# EAGLE design CAN_HB_PV&Heatpump (EAGLE 8.4.1)
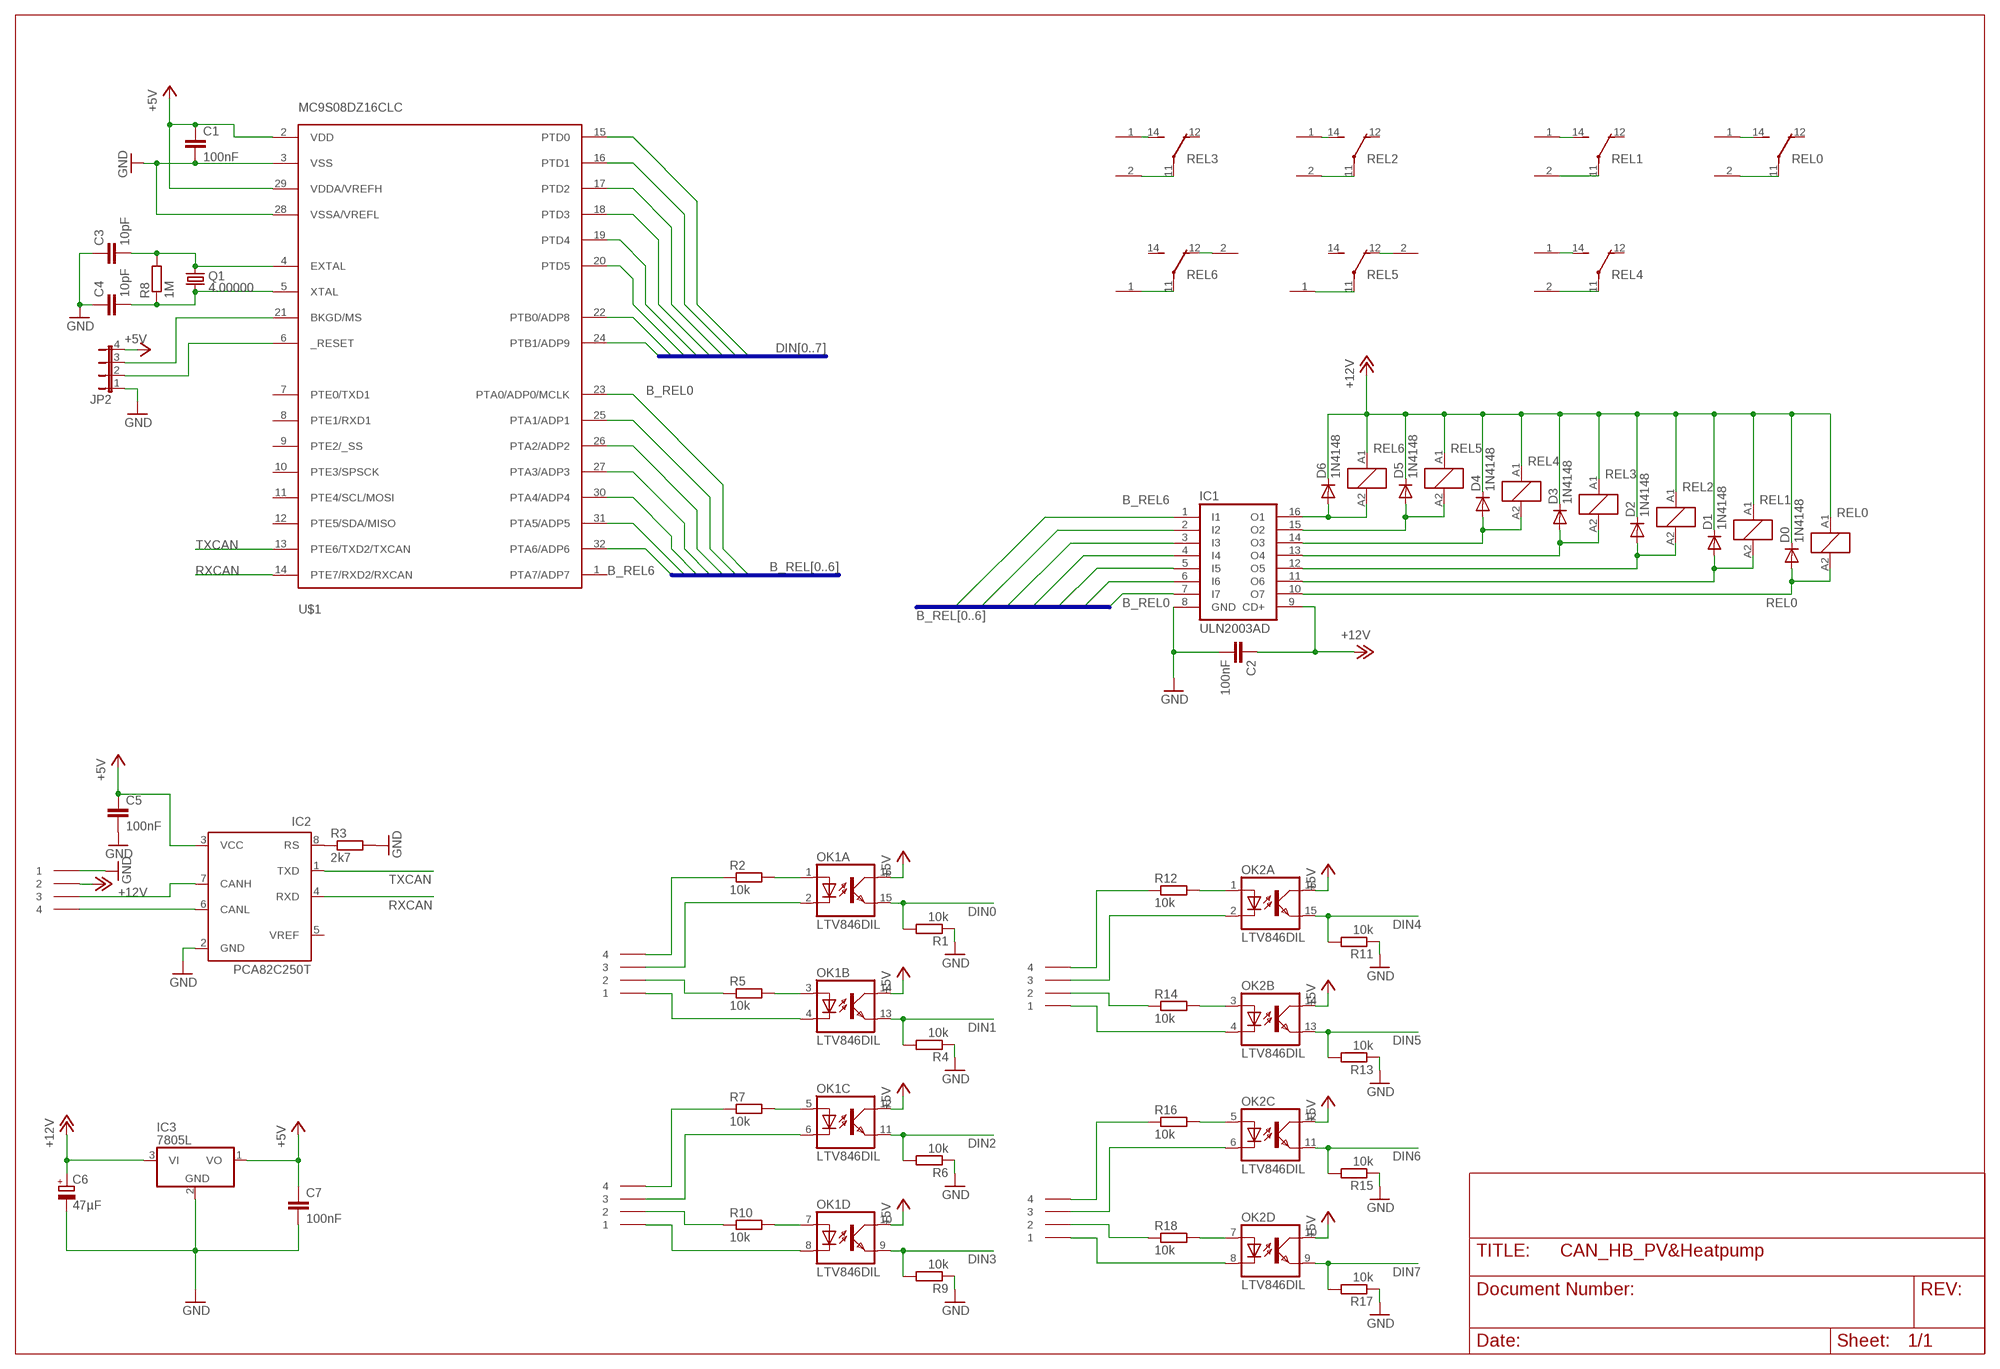
[diagram p0: schematic, sheet 1]

## Parts
C1  100nF  C-EUC0805K  [C0805K]
C2  100nF  C-EUC0805  [C0805]
C3  10pF  C-EUC0805K  [C0805K]
C4  10pF  C-EUC0805K  [C0805K]
C5  100nF  C-EUC0805  [C0805]
C6  47µF  CPOL-EUE2-5  [E2-5]
C7  100nF  C-EUC0805K  [C0805K]
D0  1N4148  DIODE-SOD80C  [SOD80C]
D1  1N4148  DIODE-SOD80C  [SOD80C]
D2  1N4148  DIODE-SOD80C  [SOD80C]
D3  1N4148  DIODE-SOD80C  [SOD80C]
D4  1N4148  DIODE-SOD80C  [SOD80C]
D5  1N4148  DIODE-SOD80C  [SOD80C]
D6  1N4148  DIODE-SOD80C  [SOD80C]
IC1  ULN2003AD  [SO16]
IC2  PCA82C250T  [SO8]
IC3  7805L  [TO92]
JP2  JP4E  [JP4]
KL1  AST021-04  [AST021-04]
KL2  AST021-04  [AST021-04]
KL3  AST021-04  [AST021-04]
KL4  AST021-04  [AST021-04]
KL5  AST021-04  [AST021-04]
OK1  LTV846DIL  [DIL16]
OK2  LTV846DIL  [DIL16]
Q1  4.00000  CRYTALHC49U-V  [HC49U-V]
R1  10k  R-EU_R0805  [R0805]
R2  10k  R-EU_R0805  [R0805]
R3  2k7  R-EU_R0805  [R0805]
R4  10k  R-EU_R0805  [R0805]
R5  10k  R-EU_R0805  [R0805]
R6  10k  R-EU_R0805  [R0805]
R7  10k  R-EU_R0805  [R0805]
R8  1M  R-EU_R0805  [R0805]
R9  10k  R-EU_R0805  [R0805]
R10  10k  R-EU_R0805  [R0805]
R11  10k  R-EU_R0805  [R0805]
R12  10k  R-EU_R0805  [R0805]
R13  10k  R-EU_R0805  [R0805]
R14  10k  R-EU_R0805  [R0805]
R15  10k  R-EU_R0805  [R0805]
R16  10k  R-EU_R0805  [R0805]
R17  10k  R-EU_R0805  [R0805]
R18  10k  R-EU_R0805  [R0805]
REL0  FIN34.51FIN34.51.7  [FIN34]
REL1  FIN34.51FIN34.51.7  [FIN34]
REL2  FIN34.51FIN34.51.7  [FIN34]
REL3  FIN34.51FIN34.51.7  [FIN34]
REL4  FIN34.51FIN34.51.7  [FIN34]
REL5  FIN34.51FIN34.51.7  [FIN34]
REL6  FIN34.51FIN34.51.7  [FIN34]
U$1  MC9S08DZ16CLC  [LQFP32]
U$2  AKL320-02  [AKL320-02]
U$3  AKL320-02  [AKL320-02]
U$4  AKL320-02  [AKL320-02]
U$5  AKL320-02  [AKL320-02]
U$6  AKL320-02  [AKL320-02]
U$14  AKL320-02  [AKL320-02]
U$15  AKL320-02  [AKL320-02]

## Nets
+5V: C1.1 C5.1 C7.1 IC2.3(VCC) IC3.1(VO) JP2.4 OK1.10(D:COL) OK1.12(C:COL) OK1.14(B:COL) OK1.16(A:COL) OK2.10(D:COL) OK2.12(C:COL) OK2.14(B:COL) OK2.16(A:COL) U$1.2(VDD) U$1.29(VDDA/VREFH)
+12V: C2.1 C6.+ D0.C D1.C D2.C D3.C D4.C D5.C D6.C IC1.9(CD+) IC3.3(VI) KL1.P$2 REL0.A1 REL1.A1 REL2.A1 REL3.A1 REL4.A1 REL5.A1 REL6.A1
B_REL0: IC1.7(I7) U$1.23(PTA0/ADP0/MCLK)
B_REL1: IC1.6(I6) U$1.25(PTA1/ADP1)
B_REL2: IC1.5(I5) U$1.26(PTA2/ADP2)
B_REL3: IC1.4(I4) U$1.27(PTA3/ADP3)
B_REL4: IC1.3(I3) U$1.30(PTA4/ADP4)
B_REL5: IC1.2(I2) U$1.31(PTA5/ADP5)
B_REL6: IC1.1(I1) U$1.32(PTA6/ADP6)
BKGD: JP2.3 U$1.21(BKGD/MS)
CANH: IC2.7(CANH) KL1.P$3
CANL: IC2.6(CANL) KL1.P$4
CH4: REL5.12(O) U$5.2
DIN0: OK1.15(A:EMIT) R1.2 U$1.15(PTD0)
DIN0+: KL2.P$4 R2.1
DIN0-: KL2.P$3 OK1.2(A:C)
DIN1: OK1.13(B:EMIT) R4.2 U$1.16(PTD1)
DIN1+: KL2.P$2 R5.1
DIN1-: KL2.P$1 OK1.4(B:C)
DIN2: OK1.11(C:EMIT) R6.2 U$1.17(PTD2)
DIN2+: KL3.P$4 R7.1
DIN2-: KL3.P$3 OK1.6(C:C)
DIN3: OK1.9(D:EMIT) R9.2 U$1.18(PTD3)
DIN3+: KL3.P$2 R10.1
DIN3-: KL3.P$1 OK1.8(D:C)
DIN4: OK2.15(A:EMIT) R11.2 U$1.19(PTD4)
DIN4+: KL4.P$4 R12.1
DIN4-: KL4.P$3 OK2.2(A:C)
DIN5: OK2.13(B:EMIT) R13.2 U$1.20(PTD5)
DIN5+: KL4.P$2 R14.1
DIN5-: KL4.P$1 OK2.4(B:C)
DIN6: OK2.11(C:EMIT) R15.2 U$1.22(PTB0/ADP8)
DIN6+: KL5.P$4 R16.1
DIN6-: KL5.P$3 OK2.6(C:C)
DIN7: OK2.9(D:EMIT) R17.2 U$1.24(PTB1/ADP9)
DIN7+: KL5.P$2 R18.1
DIN7-: KL5.P$1 OK2.8(D:C)
GND: C1.2 C2.2 C3.1 C4.1 C5.2 C6.- C7.2 IC1.8(GND) IC2.2(GND) IC3.2(GND) JP2.1 KL1.P$1 R1.1 R3.2 R4.1 R6.1 R9.1 R11.1 R13.1 R15.1 R17.1 U$1.3(VSS) U$1.28(VSSA/VREFL)
N$1: REL3.11(P) U$2.2
N$2: OK1.1(A:A) R2.2
N$3: IC2.8(RS) R3.1
N$4: REL6.11(P) U$3.1
N$5: REL3.14(S) U$2.1
N$6: REL2.14(S) U$4.1
N$7: REL2.11(P) U$4.2
N$9: C4.2 Q1.1 R8.1 U$1.5(XTAL)
N$10: C3.2 Q1.2 R8.2 U$1.4(EXTAL)
N$11: REL4.11(P) U$14.2
N$12: REL4.14(S) U$14.1
N$13: REL1.11(P) U$6.2
N$14: REL1.14(S) U$6.1
N$15: REL0.11(P) U$15.2
N$16: REL0.14(S) U$15.1
N$17: REL5.11(P) U$5.1
N$20: REL6.12(O) U$3.2
N$23: OK1.3(B:A) R5.2
N$26: OK1.5(C:A) R7.2
N$28: OK1.7(D:A) R10.2
N$32: OK2.1(A:A) R12.2
N$38: OK2.3(B:A) R14.2
N$42: OK2.5(C:A) R16.2
N$44: OK2.7(D:A) R18.2
REL0: D0.A IC1.10(O7) REL0.A2
REL1: D1.A IC1.11(O6) REL1.A2
REL2: D2.A IC1.12(O5) REL2.A2
REL3: D3.A IC1.13(O4) REL3.A2
REL4: D4.A IC1.14(O3) REL4.A2
REL5: D5.A IC1.15(O2) REL5.A2
REL6: D6.A IC1.16(O1) REL6.A2
RESET: JP2.2 U$1.6(_RESET)
RXCAN: IC2.4(RXD) U$1.14(PTE7/RXD2/RXCAN)
TXCAN: IC2.1(TXD) U$1.13(PTE6/TXD2/TXCAN)
Unconnected: IC2.5(VREF) REL0.12(O) REL1.12(O) REL2.12(O) REL3.12(O) REL4.12(O) REL5.14(S) REL6.14(S) U$1.1(PTA7/ADP7) U$1.7(PTE0/TXD1) U$1.8(PTE1/RXD1) U$1.9(PTE2/_SS) U$1.10(PTE3/SPSCK) U$1.11(PTE4/SCL/MOSI) U$1.12(PTE5/SDA/MISO)

## Buses
B_REL[0..6]
DIN[0..7]

## Library data of the parts
C1-C5 C7 = rcl:C-EU: CAPACITOR, European symbol
C6 = rcl:CPOL-EU: POLARIZED CAPACITOR, European symbol
D0 D1-D6 = diode:DIODE-: DIODE
IC1 = uln-udn:ULN2003A: DRIVER ARRAY
IC2 = micro-philips:PCA82C250: CAN CONTROLLER INTERFACE
IC3 = linear:78*: Positive VOLTAGE REGULATOR
JP2 = jumper:JP4E: JUMPER
KL1-KL5 = con-ria:AST021-04
OK1 OK2 = optocoupler:LTV846: OPTO COUPLER Source: LITEON, LTV816.pdf
Q1 = crystal:CRYTAL: CRYSTAL
R1-R18 = rcl:R-EU_: RESISTOR, European symbol
REL0 REL1-REL6 = My:FIN34.51: Finder 34.51.7 Relais
U$1 = MC9S08DZ16CLC:MC9S08DZ16CLC
U$2-U$6 U$14 U$15 = con-ria:AKL320-02

## Board
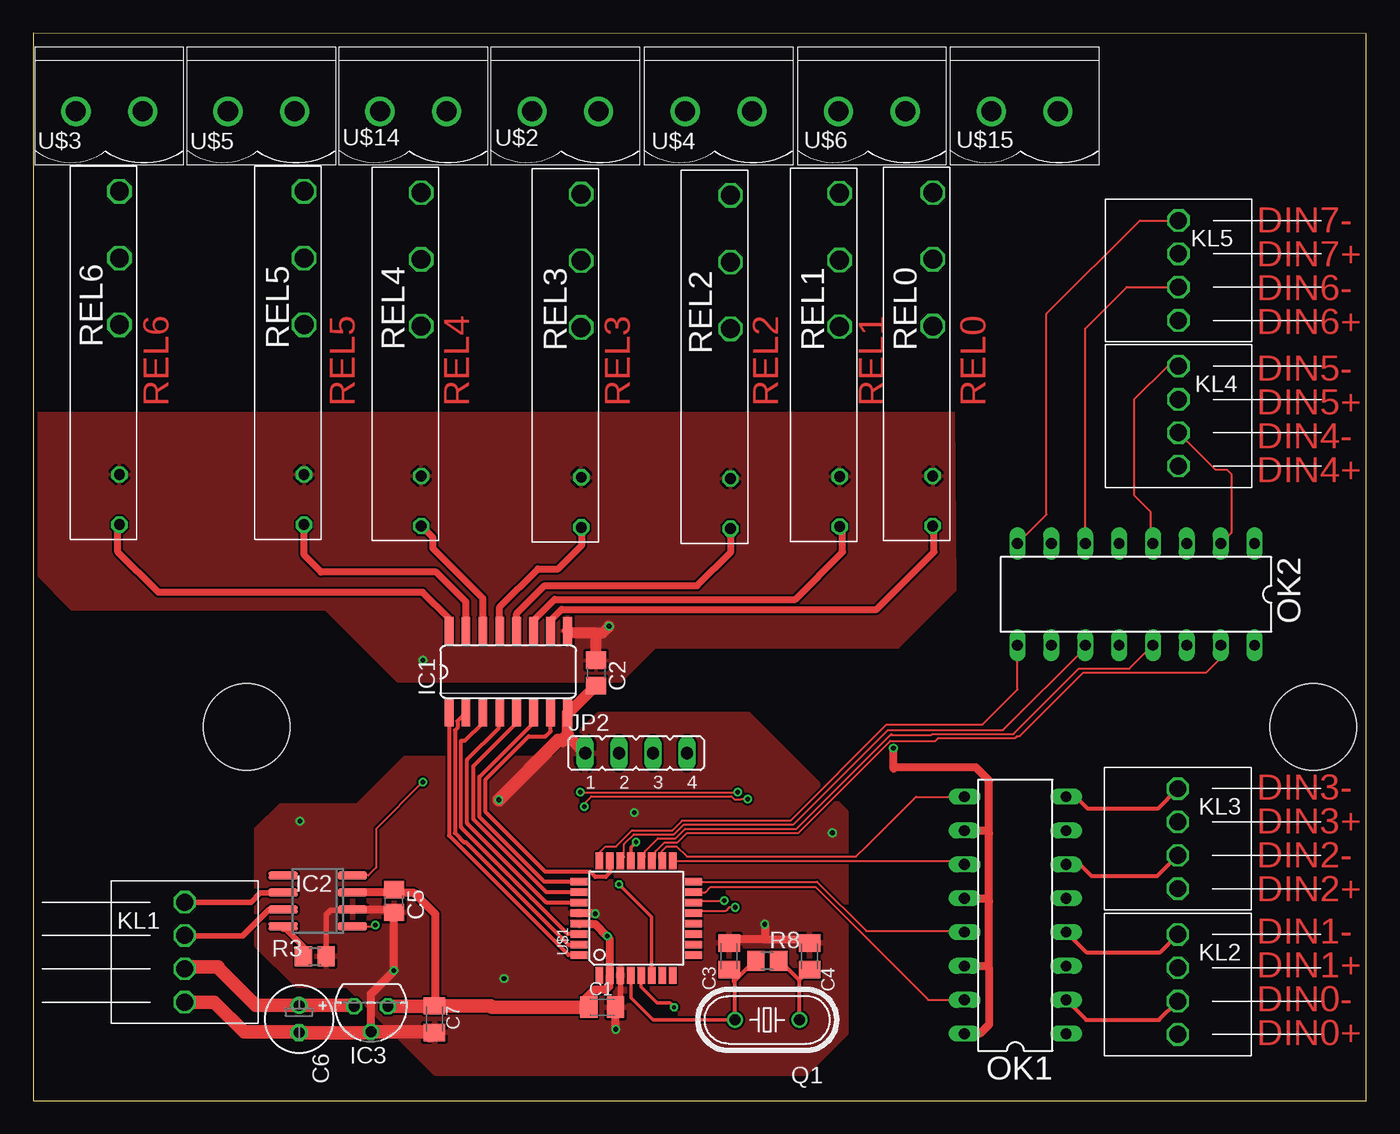
[diagram p1: board, top side]
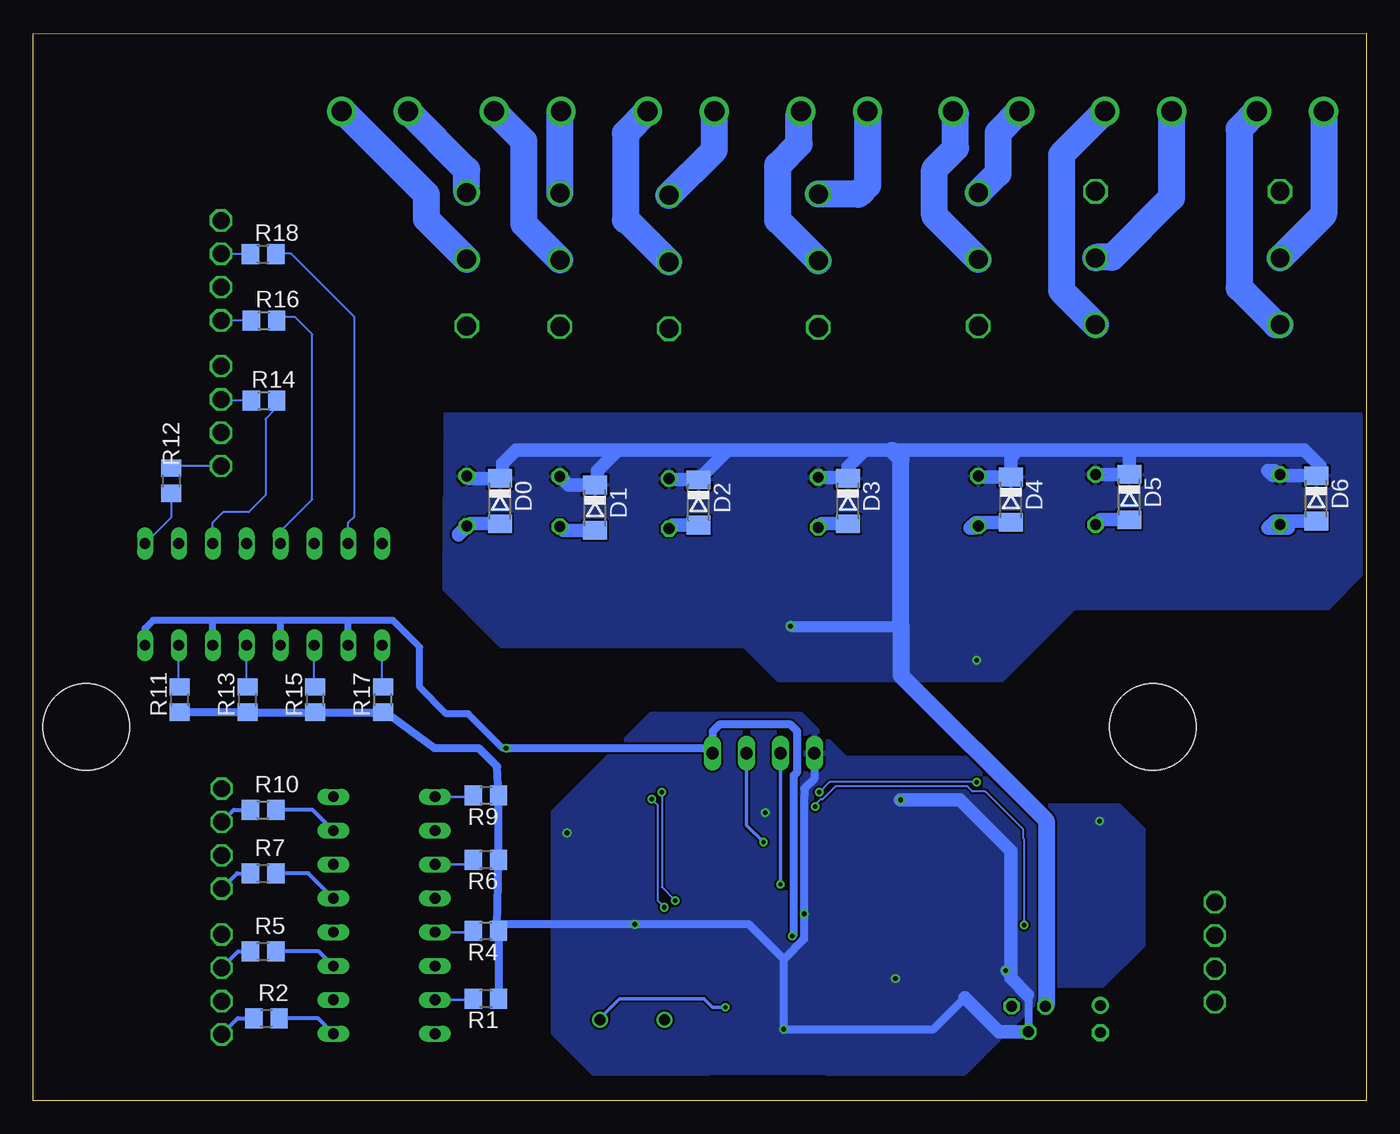
[diagram p2: board, bottom side, seen from below]

Size 99.97 x 80.06 mm. Coordinates in mm from the lower left corner, seen from the top.
Outline: 0,0 99.96,0 99.97,80.01 0,80.06 0,0
Copper layers (1*16): Top 0.035mm / dielectric 1.5mm / Bottom 0.035mm
Design rules "PCB-POOL Standard": minimum track width 0.15mm, minimum drill 0.3mm, track to track 0.15mm, track to pad 0.15mm, pad to pad 0.15mm, via to via 0.15mm, smd to smd 0.15mm, copper to edge 0.3mm, drill to drill 0.2mm, minimum pad ring 0.2mm, minimum via ring 0.15mm, stop-mask expansion 0.075mm, vias tented up to drill 0mil, thermal gap 0.2mm
Holes 6.5 mm at 96,28.02 15.99,28.02

### Footprints (pad centres in the part's own frame; a part is rotated, then mirrored left to right if it is on the bottom)
C0805K = smd 1.3 x 1.6: 1 -1,0; 2 1,0
C0805 = smd 1.3 x 1.5: 1 -0.95,0; 2 0.95,0
C0805' = smd 1.3 x 1.5: 1 -0.85,0; 2 0.85,0
E2-5 = drill 0.813 pad 1.27: + -1.016,0 | drill 0.813 pad 1.27 octagon: - 1.016,0
SOD80C = smd 1.4 x 1.8: A 1.7,0; C -1.7,0
SO16 = smd 0.66 x 2.032: 1 -4.445,-3.073; 2 -3.175,-3.073; 3 -1.905,-3.073; 4 -0.635,-3.073; 5 0.635,-3.073; 6 1.905,-3.073; 7 3.175,-3.073; 8 4.445,-3.073; 9 4.445,3.073; 10 3.175,3.073; 11 1.905,3.073; 12 0.635,3.073; 13 -0.635,3.073; 14 -1.905,3.073; 15 -3.175,3.073; 16 -4.445,3.073
SO8 = smd 0.6 x 2.2: 1 -1.905,-2.6; 2 -0.635,-2.6; 3 0.635,-2.6; 4 1.905,-2.6; 5 1.905,2.6; 6 0.635,2.6; 7 -0.635,2.6; 8 -1.905,2.6
TO92 = drill 0.813 octagon: 1 -1.27,0; 2 0,1.905; 3 1.27,0
JP4 = drill 0.914 long: 1 -3.81,0; 2 -1.27,0; 3 1.27,0; 4 3.81,0
AST021-04 = drill 1.27 octagon: P$1 0,0; P$2 0,2.5; P$3 0,5; P$4 0,7.5
DIL16 = drill 0.813 long: 1 -8.89,-3.81; 2 -6.35,-3.81; 3 -3.81,-3.81; 4 -1.27,-3.81; 5 1.27,-3.81; 6 3.81,-3.81; 7 6.35,-3.81; 8 8.89,-3.81; 9 8.89,3.81; 10 6.35,3.81; 11 3.81,3.81; 12 1.27,3.81; 13 -1.27,3.81; 14 -3.81,3.81; 15 -6.35,3.81; 16 -8.89,3.81
HC49U-V = drill 0.813: 1 -2.413,0; 2 2.413,0
R0805 = smd 1.3 x 1.5: 1 -0.95,0; 2 0.95,0
R0805' = smd 1.3 x 1.5: 1 -0.85,0; 2 0.85,0
FIN34 = drill 1.422 octagon: 11 21.1,1.3; 12 16.1,1.3; 14 26.1,1.3 | drill 0.813 octagon: A1 4.85,1.3; A2 1.1,1.3
LQFP32 = smd 1.27 x 0.559: 1 -4.293,2.743; 2 -4.293,1.956; 3 -4.293,1.168; 4 -4.293,0.381; 5 -4.293,-0.381; 6 -4.293,-1.168; 7 -4.293,-1.956; 8 -4.293,-2.743; 17 4.293,-2.743; 18 4.293,-1.956; 19 4.293,-1.168; 20 4.293,-0.381; 21 4.293,0.381; 22 4.293,1.168; 23 4.293,1.956; 24 4.293,2.743 | smd 0.559 x 1.27: 9 -2.743,-4.293; 10 -1.956,-4.293; 11 -1.168,-4.293; 12 -0.381,-4.293; 13 0.381,-4.293; 14 1.168,-4.293; 15 1.956,-4.293; 16 2.743,-4.293; 25 2.743,4.293; 26 1.956,4.293; 27 1.168,4.293; 28 0.381,4.293; 29 -0.381,4.293; 30 -1.168,4.293; 31 -1.956,4.293; 32 -2.743,4.293
AKL320-02 = drill 1.5 pad 2.184: 1 0,0; 2 0,5

### Placement (x,y rotation side)
C1  42.67,7.01 0 top
C2  42.22,32.09 270 top
C3  52.19,10.82 270 top
C4  58.22,10.82 270 top
C5  100nF  [C0805']  27.05,14.98 270 top
C6  19.93,6.12 270 top
C7  30.09,6.12 270 top
D0  64.98,44.98 270 bottom
D1  57.85,44.47 270 bottom
D2  50.07,44.87 270 bottom
D3  38.87,44.97 270 bottom
D4  26.67,45.07 270 bottom
D5  17.77,45.27 270 bottom
D6  3.73,45.17 270 bottom
IC1  35.62,32.17 0 top
IC2  21.33,14.98 90 top
IC3  25.33,7.07 180 top
JP2  45.21,26.06 0 top
KL1  11.36,7.39 0 top
KL2  85.85,12.47 180 top
KL3  85.85,23.4 180 top
KL4  85.89,55.1 180 top
KL5  85.89,66.03 180 top
OK1  73.66,13.91 90 top
OK2  82.7,37.98 180 top
Q1  55.05,6.06 180 top
R1  66.02,7.64 180 bottom
R2  82.48,6.18 0 bottom
R3  2k7  [R0805']  21.12,10.83 0 top
R4  66.02,12.72 180 bottom
R5  82.74,11.2 0 bottom
R6  66.02,18.05 180 bottom
R7  82.74,17.05 0 bottom
R8  1M  [R0805']  55.05,10.5 180 top
R9  66.02,22.88 180 bottom
R10  82.74,21.82 0 bottom
R11  88.98,30.09 90 bottom
R12  89.63,46.5 270 bottom
R13  83.9,30.09 90 bottom
R14  82.67,52.5 0 bottom
R15  78.81,30.09 90 bottom
R16  82.67,58.52 0 bottom
R17  73.73,30.09 90 bottom
R18  82.74,63.5 0 bottom
REL0  68.76,42.01 90 top
REL1  61.78,41.96 90 top
REL2  53.59,41.8 90 top
REL3  42.39,41.9 90 top
REL4  30.39,42 90 top
REL5  21.6,42.1 90 top
REL6  7.76,42.1 90 top
U$1  45.21,13.68 90 top
U$2  37.39,74.2 270 top
U$3  3.2,74.2 270 top
U$4  48.89,74.2 270 top
U$5  14.59,74.2 270 top
U$6  60.39,74.2 270 top
U$14  26,74.2 270 top
U$15  71.85,74.2 270 top

### Tracks (layer width: path | path; a pad name or v marks a point on that pad's centre or on a via)
+5V  (via drill 0.35)
  Top 0.152: 49.27,25.81 JP2.4
  Top 0.305: 26.41,15.62 27.05,15.62 | C5.1 27.05,15.93 26.73,15.93
  Top 0.61: C7.1 30.14,7.12 30.14,14 28.52,15.62 27.05,15.62 | C5.1 26.83,15.83 26.73,15.93 26.41,15.62 IC2.3 | C1.1 41.4,7.28 41.4,7.64 42.05,8.3 42.93,8.3 43.2,8.56 43.2,9.33 U$1.2 43.25,12.14 v43.05,12.34 42.16,13.23 41.75,13.23 41.74,13.24 40.97,13.24 U$1.29 | 64.51,24.91 64.51,25.02 | 64.51,25.02 v64.51,26.44 | 64.51,25.02 70.68,25.02 71.68,24.02 71.68,20.02 | 71.68,14.94 71.68,20.02 | 71.68,9.86 71.68,14.94 | 71.68,9.86 71.68,5.7 71,5.02 OK1.16 | OK1.10 71.44,20.26 arc-90 71.68,20.02 | OK1.12 71.44,15.18 arc-90 71.68,14.94 | OK1.14 71.44,10.1 arc-90 71.68,9.86
  Top 1.016: IC3.1 30.09,7.07 C7.1 30.1,7.13 34.28,7.13 34.41,7.01 C1.1
  Bottom 0.508: v64.51,26.44 64.77,26.44 67.35,29.02 69,29.02 71,31.02 71,34.02 73,36.02 76.36,36.02 | 81.44,36.02 86.52,36.02 | 76.36,36.02 81.44,36.02 | 86.52,36.02 91,36.02 91.59,35.42 OK2.16 | OK2.14 86.52,36.02 | OK2.12 81.44,36.02 | OK2.10 76.36,36.02
  Bottom 0.61: v43.05,12.34 42.92,12.47 42.92,24.4 42.67,24.66 42.67,27.71 43.17,28.21 48.51,28.21 49.02,27.71 JP2.4 49.02,26.44 v64.51,26.44
+12V  (via drill 0.35)
  Top 0.813: IC1.9 40.24,35.07 42.22,35.07 | v43.17,35.58 42.67,35.07 42.22,35.07 | C2.1 42.22,35.07
  Top 1.016: IC3.3 23.99,7.14 C6.+ 16.69,7.14 13.85,9.97 13.85,10.04 11.5,10.04 KL1.P$2
  Bottom 0.15: REL6.A1 6.42,46.95 6.34,46.87
  Bottom 0.813: KL1.P$2 11.36,9.96 | v43.17,35.58 34.88,35.58
  Bottom 1.016: 6.85,47.26 7.36,47.26 6.97,46.87 6.34,46.87 D6.C 3.42,47.52 | REL5.A1 17.79,46.95 D5.C | REL4.A1 29.02,46.77 D4.C 26.67,48.28 26.16,48.79 | 17.78,46.98 D5.C | REL3.A1 38.95,46.75 D3.C 38.87,47.51 37.59,48.79 | 37.59,48.79 35.55,48.79 26.16,48.79 | 37.59,48.79 47.85,48.79 | 47.85,48.79 D2.C 52.21,46.57 REL2.A1 | 47.85,48.79 56.13,48.79 | 56.13,48.79 57.65,47.26 57.65,46.37 D1.C 59.84,46.17 REL1.A1 | 56.13,48.79 63.75,48.79 64.77,47.77 64.77,46.89 D0.C 67.28,46.68 REL0.A1 | 17.78,48.79 26.16,48.79 | 17.78,48.79 4.63,48.79 3.49,47.64 | D5.C 17.77,48.78 17.78,48.79
  Bottom 1.27: IC3.3 24,7.13 24,21.02 34.88,31.91 34.88,35.58 34.88,48.12 35.55,48.79
  other vias: 29.21,33.04
  pour Top: 0.25,51.58 0.25,39.45 2.85,36.85 21.9,36.85 27.3,31.45 44.13,31.45 46.67,33.99 64.89,33.99 69.21,38.31 69.21,38.44 69.08,51.58
  pour Bottom: 0.25,51.58 0.25,39.45 2.85,36.85 21.9,36.85 27.3,31.45 44.13,31.45 46.67,33.99 64.89,33.99 69.21,38.31 69.21,39.07 69.08,51.58
B_REL0
  Top 0.305: U$1.23 43.25,17.11 42.92,16.78 42.16,16.78 41.78,17.16 38.41,17.16 33.92,21.65 33.92,24.1 37.15,27.32 38.41,27.32 38.79,27.71 IC1.7
B_REL1
  Top 0.305: 40.35,16.42 U$1.25 38.34,16.42 33.47,21.29 33.47,24.29 37.59,28.4 37.59,29.04 IC1.6
B_REL2
  Top 0.305: U$1.26 38.48,15.63 33.02,21.1 33.02,25.1 36.19,28.28 36.19,29.04 IC1.5
B_REL3
  Top 0.305: U$1.27 38.51,14.85 32.54,20.82 32.54,25.58 34.92,27.96 34.92,29.04 IC1.4
B_REL4
  Top 0.305: U$1.30 40.08,12.51 32.08,20.51 32.08,27.01 32.38,27.01 33.71,28.34 IC1.3
B_REL5
  Top 0.15: 40.89,11.7 U$1.31
  Top 0.305: 40.89,11.7 40.13,11.7 32.44,19.39 32.32,19.39 31.63,20.08 31.63,27.78 31.81,27.96 31.81,28.46 IC1.2
B_REL6
  Top 0.305: U$1.32 40.13,10.94 31.17,19.89 IC1.1
BKGD  (via drill 0.3)
  Top 0.254: U$1.21 44.83,19.01 v45.21,19.39
  Bottom 0.254: v45.21,19.39 46.48,20.66 JP2.3
CANH
  Top 0.406: IC2.7 17.68,14.35 15.71,12.38 11.37,12.38 KL1.P$3
CANL
  Top 0.406: KL1.P$4 16.32,14.89 17.01,15.58 18.7,15.58 IC2.6
CH4
  Bottom 2.032: U$5.2 22.86,70.94 22.86,60.76 REL5.12
DIN0
  Top 0.15: 50.79,16.02 58.67,16.02 58.8,15.89
  Top 0.152: U$1.15 50.41,15.63 50.79,16.02 | 58.8,15.89 67.13,7.56 OK1.15
  Bottom 0.2: OK1.15 66.95,7.56 R1.2
DIN0+
  Bottom 0.305: KL2.P$4 84.63,6.18 R2.1
DIN0-
  Top 0.305: OK1.2 78.97,6.05 84.43,6.05 KL2.P$3
DIN1
  Top 0.152: U$1.16 58.78,16.42 62.48,12.72 69.77,12.72 OK1.13
  Bottom 0.2: OK1.13 66.95,12.64 R4.2
DIN1+
  Bottom 0.305: KL2.P$2 84.62,11.2 R5.1
DIN1-
  Top 0.305: OK1.4 78.97,11.13 84.51,11.13 KL2.P$1
DIN2
  Top 0.152: U$1.17 69.59,17.97 OK1.11
  Bottom 0.2: OK1.11 67.2,17.72 R6.2
DIN2+
  Bottom 0.305: KL3.P$4 84.7,17.05 R7.1
DIN2-
  Top 0.305: OK1.6 78.5,17.72 79.37,16.85 84.29,16.85 KL3.P$3
DIN3
  Top 0.15: 47.49,19.07 48.25,19.07 49.02,18.31 61.72,18.31 62.48,19.07
  Top 0.152: U$1.18 47.16,18.74 47.49,19.07 | 62.48,19.07 66.21,22.8 OK1.9
  Bottom 0.2: OK1.9 66.95,22.8 R9.2
DIN3+
  Bottom 0.305: KL3.P$2 84.93,21.82 R10.1
DIN3-
  Top 0.305: OK1.8 78.18,22.8 79.05,21.93 84.37,21.93 KL3.P$1
DIN4
  Top 0.152: U$1.19 46.66,18.25 46.66,18.7 47.33,19.37 48.3,19.37 49.02,20.09 57.38,20.09 64.28,26.99 67.67,26.99 67.88,27.2 73.64,27.2 73.77,27.32 73.97,27.32 78.73,32.09 87.94,32.09 89.06,33.2 OK2.15
  Bottom 0.152: R11.2 89.06,31.02 OK2.15
DIN4+
  Bottom 0.152: KL4.P$4 89.38,47.6 R12.1
DIN4-
  Top 0.152: KL4.P$3 88.67,47.33 89.53,47.33 89.85,47.01 89.85,42.58 OK2.2
DIN5
  Top 0.15: 64.29,27.42 67.36,27.42 67.43,27.5
  Top 0.152: U$1.20 45.87,18.25 45.87,18.7 46.84,19.67 48.18,19.67 48.89,20.39 57.26,20.39 64.29,27.42 64.37,27.5 | 67.43,27.5 73.51,27.5 78.42,32.4 82.21,32.4 OK2.13
  Bottom 0.152: R13.2 83.98,31.02 OK2.13
DIN5+
  Bottom 0.152: R14.1 85.79,52.5 KL4.P$2
DIN5-
  Top 0.152: OK2.4 83.81,41.95 83.81,44.15 82.55,45.42 82.55,52.57 85.08,55.1 KL4.P$1
DIN6
  Top 0.15: 64.1,27.8 72.74,27.8 78.9,33.96 OK2.11
  Top 0.152: U$1.22 44.32,18.25 44.32,19.25 45.04,19.98 48.05,19.98 48.77,20.69 56.99,20.69 64.1,27.8
  Bottom 0.152: R15.2 78.9,31.02 OK2.11
DIN6+
  Bottom 0.152: R16.1 85.88,58.52 KL5.P$4
DIN6-
  Top 0.152: OK2.6 78.9,57.92 82,61.03 KL5.P$3
DIN7
  Top 0.15: 64,28.21 71.19,28.21 73.81,30.84 OK2.9
  Top 0.152: U$1.24 42.46,18.61 42.92,19.07 43.71,19.07 44.92,20.28 47.93,20.28 48.64,20.99 56.78,20.99 64,28.21
  Bottom 0.152: R17.2 73.81,31.02 OK2.9
DIN7+
  Bottom 0.152: R18.1 85.87,63.5 KL5.P$2
DIN7-
  Top 0.152: OK2.8 76,43.97 76,59.02 83,66.03 KL5.P$1
GND  (via drill 0.35)
  Top 0.406: C1.2 43.62,7.01 44.04,7.43 U$1.3 | R3.2 21.97,13.93 22.31,14.28 23.87,14.28 IC2.2
  Top 0.61: C7.2 30.09,5.17 | IC3.2 25.33,8.03 v27.05,9.75 27.05,14.03 | 27.05,14.03 C5.2 | IC2.2 26.73,14.35 27.05,14.03 | v42.14,14.01 42.09,14.06 U$1.28 | v43.68,5.35 43.67,5.37 C1.2 | C4.1 57.67,11.82 57.4,12.09 54.86,12.09 | C3.1 52.46,12.09 54.86,12.09 | v54.86,13.23 54.86,12.09
  Top 0.813: JP2.1 40.06,27.39 IC1.8 40.19,29.1 C2.2
  Top 1.016: KL1.P$1 13.58,7.39 15.8,5.17 19.93,5.17 C6.- 25.26,5.1 IC3.2 29.45,5.17 29.77,4.85 30.04,5.12 C7.2 | 40.06,27.39 39.68,27.01 39.37,27.01 v34.92,22.56
  Bottom 0.2: 65.17,13.02 R4.1
  Bottom 0.61: JP2.1 41.4,24.15 42.14,23.41 42.14,22.81 42.16,22.79 42.16,13.99 v42.14,14.01 42.16,13.99 42.16,12.12 43.68,10.6 | 30.09,7.71 32.44,5.35 v43.68,5.35 43.68,10.6 | 43.68,10.6 46.31,13.23 v54.86,13.23 64.96,13.23 65.17,13.02 R6.1 R9.1 65.17,25.06 66.54,26.44 69.84,26.44 73.65,29.24 R17.1 R15.1 R13.1 R11.1 | 25.39,7.96 25.33,7.89 IC3.2 | R4.1 R1.1
  Bottom 0.813: v27.05,9.75 26.67,9.36 26.67,9.23
  Bottom 1.016: 30.09,7.71 27.55,5.17 IC3.2 | 25.39,7.96 26.67,9.23 26.67,18.75 30.48,22.56 v34.92,22.56
  other vias: 35.3,9.16 59.94,20.09 45.08,21.61 20,20.97
  pour Bottom: 57.91,2.05 60.95,5.1 60.95,21.61 53.59,28.98 42.41,28.98 39.11,25.67 27.94,25.67 24.38,22.12 18.54,22.12 16.76,20.34 16.76,11.7 19.81,8.66 23.62,8.66 30.22,2.05 40.38,2.05 40.63,2.11
  pour Top: 16.76,20.34 18.54,22.12 24.38,22.12 27.94,25.67 39.11,25.67 42.41,28.98 53.59,28.98 60.95,21.61 60.95,5.1 57.91,2.05 30.22,2.05 23.62,8.66 19.81,8.66 16.76,11.7 16.76,19.07
N$1
  Bottom 2.032: REL3.11 44.13,66.04 44.13,70.19 42.54,71.77 42.54,74.06 U$2.2
N$2
  Bottom 0.305: OK1.1 78.62,6.18 R2.2
N$3
  Top 0.406: 18.73,12.87 IC2.8 20.27,11.54 R3.1
N$4
  Bottom 2.032: U$3.1 3.2,66.47 REL6.11
N$5
  Bottom 2.032: U$2.1 37.39,68.66 38.09,67.96 38.13,68 REL3.14
N$6
  Bottom 2.032: REL2.14 48.89,71.3 U$4.1
N$7
  Bottom 2.032: U$4.2 55.56,72.54 55.56,66.06 55.45,66.06 REL2.11
N$9  (via drill 0.3)
  Top 0.254: 58.22,9.87 C4.2 58.22,9.8 57.46,9.04 | U$1.5 45.59,8.53 46.79,7.33 47.75,7.33 v48.06,7.01
  Top 0.305: 57.59,6.06 Q1.1 57.46,9.04 56,10.5 R8.1
  Bottom 0.254: Q1.1 57.59,6.06 56,7.65 49.65,7.65 49.02,7.01 v48.06,7.01
N$10
  Top 0.254: 52.64,9.04 52.51,8.92 52.51,9.5 C3.2 | U$1.4 44.83,7.71 46.48,6.06 Q1.2
  Top 0.305: R8.2 54.1,10.5 52.64,9.04 Q1.2
N$11
  Bottom 2.032: REL4.11 32.38,66.39 32.38,69.87 30.79,71.46 30.79,74 U$14.2
N$12
  Bottom 2.032: U$14.1 27.62,72.58 27.62,69.55 29.07,68.1 REL4.14
N$13
  Bottom 2.032: REL1.11 63.18,65.76 63.18,71.99 U$6.2
N$14
  Bottom 2.032: REL1.14 60.48,74.12 U$6.1
N$15
  Bottom 2.032: REL0.11 70.48,66.13 70.48,67.96 76.72,74.2 U$15.2
N$16
  Bottom 2.032: REL0.14 67.46,69.81 U$15.1
N$17
  Bottom 2.032: U$5.1 14.59,67.72 19.05,63.27 20.23,63.27 REL5.11
N$20
  Bottom 2.032: U$3.2 9.52,72.88 9.52,60.98 6.74,58.2 REL6.12
N$23
  Bottom 0.305: OK1.3 78.56,11.2 R5.2
N$26
  Bottom 0.305: OK1.5 79.34,17.05 R7.2
N$28
  Bottom 0.305: OK1.7 79.02,21.82 R10.2
N$32
  Bottom 0.152: R12.2 89.63,43.76 OK2.1
N$38
  Bottom 0.152: OK2.3 86.52,43.36 85.72,44.15 83.81,44.15 82.55,45.42 82.55,51.14 81.82,51.86 R14.2
N$42
  Bottom 0.152: OK2.5 81.44,42.72 79.05,45.1 79.05,57.49 80.32,58.76 81.58,58.76 R16.2
N$44
  Bottom 0.152: OK2.7 76.36,43.36 75.88,43.83 75.88,58.76 80.64,63.52 81.87,63.52 R18.2
REL0
  Top 0.508: IC1.10 38.79,36.02 39.62,36.85 63.24,36.85 67.56,41.17 67.56,43.01 REL0.A2
  Bottom 1.016: D0.A 67.22,43.28 68.07,42.44 68.07,42.5 REL0.A2
REL1
  Top 0.508: IC1.11 37.52,36.02 39.11,37.61 57.14,37.61 60.7,41.17 60.7,42.83 REL1.A2
  Bottom 1.016: D1.A 60.19,42.77 REL1.A2
REL2
  Top 0.508: IC1.12 36.25,36.53 38.35,38.63 49.78,38.63 52.32,41.17 52.32,42.88 REL2.A2
  Bottom 1.016: D2.A 52.02,43.17 REL2.A2
REL3
  Top 0.508: IC1.13 34.98,37.04 37.84,39.9 39.36,39.9 41.14,41.68 41.14,42.96 REL3.A2
  Bottom 1.016: D3.A 40.82,43.27 REL3.A2
REL4
  Top 0.508: IC1.14 33.71,37.67 29.97,41.42 29.97,42.23 REL4.A2
  Bottom 1.016: D4.A 29.29,43.37 29.71,42.95 29.25,42.95 REL4.A2
REL5
  Top 0.508: IC1.15 32.44,37.42 30.22,39.64 21.59,39.64 20.32,40.91 20.32,43.18 REL5.A2
  Bottom 1.016: D5.A 19.93,43.57 REL5.A2
REL6
  Top 0.508: IC1.16 31.17,36.15 29.21,38.12 9.39,38.12 6.34,41.17 6.34,43.09 REL6.A2
  Bottom 1.016: D6.A 6.83,43.47 7.36,42.95 6.2,42.95 | 5.84,42.95 6.2,42.95 | 6.2,42.95 REL6.A2
RESET  (via drill 0.3)
  Top 0.254: U$1.6 46.38,13.78 v43.94,16.22
  Bottom 0.254: v43.94,16.22 JP2.2
RXCAN  (via drill 0.35)
  Top 0.15: 28.95,23.9 v29.21,23.9 | v41.02,23.13 v52.83,23.13 | 49.66,15.01 v51.81,15.01
  Top 0.152: U$1.14 49.66,15.01 | v29.21,23.9 25.71,20.4 25.71,17.48 25.12,16.89 IC2.4
  Bottom 0.15: v29.21,23.9 40.25,23.9 v41.02,23.13 | v52.83,23.13 52.83,16.02 v51.81,15.01
TXCAN  (via drill 0.35)
  Top 0.15: v52.64,14.5 52.19,14.5 51.94,14.24 49.68,14.24
  Top 0.152: U$1.13 49.68,14.24 | v41.33,22.05 41.33,22.31 41.86,22.83 52.35,22.83 52.6,22.58 53.05,22.58 53.1,22.63 v53.59,22.63 | IC2.1 25.56,13.08 v25.65,13.16
  Bottom 0.15: 38.6,23.58 29.9,23.58 29.52,23.2 28.57,23.2 25.71,20.34 25.71,19.7 25.65,19.58 v25.65,13.16 | 52.57,14.5 v52.64,14.5
  Bottom 0.152: 38.6,23.58 39.79,23.58 40.79,22.58 40.93,22.58 41.33,22.18 v41.33,22.05 | v52.64,14.5 53.13,14.99 53.13,22.16 v53.59,22.63

### Text on the board
Top: DIN7- | DIN7+ | DIN6- | DIN6+ | DIN5- | REL6 | REL5 | REL4 | REL3 | REL2 | REL1 | REL0 | DIN5+ | DIN4- | DIN4+ | DIN3- | DIN3+ | DIN2- | DIN2+ | DIN1- | DIN1+ | DIN0- | DIN0+